# EAGLE design Audio Board (EAGLE 9.3.1)

## Sheet 1 of 3
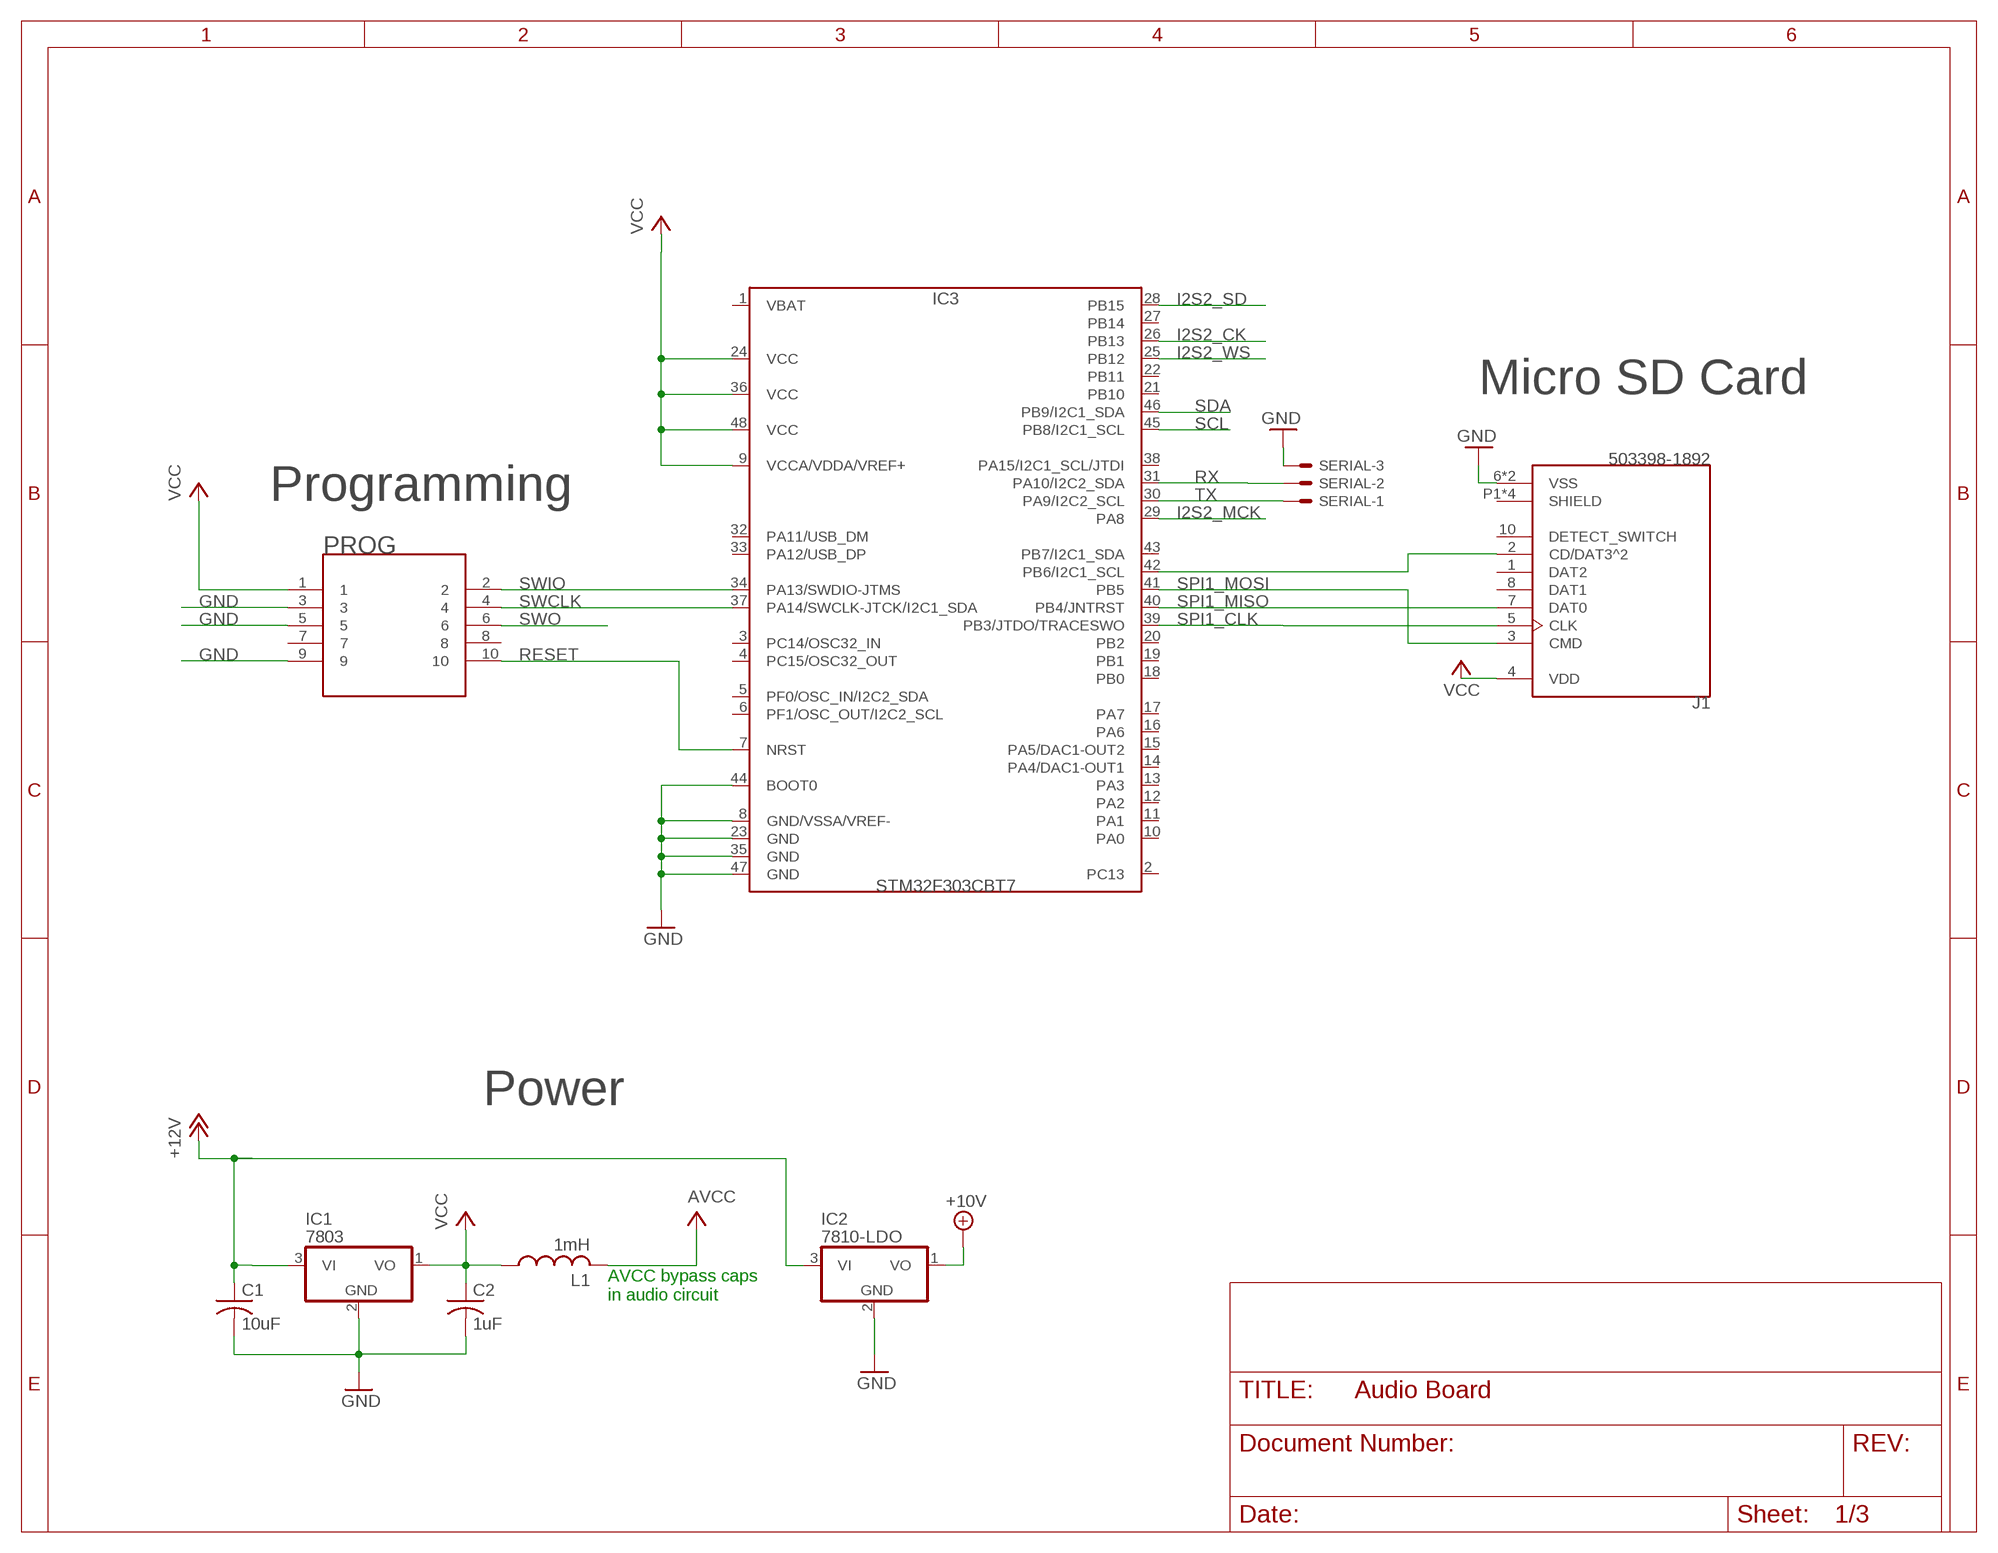
[diagram p0: schematic, sheet 1]

### Parts
C1  10uF  C-US025-025X050  [C025-025X050]
C2  1uF  C-US025-025X050  [C025-025X050]
IC1  7803  78L05Z  [TO92]
IC2  7810-LDO  78L05Z  [TO92]
IC3  STM32F303CBT7  [LQFP48]
J1  503398-1892  [MOLEX_503398-1892]
L1  1mH  L-US0207/10  [0207/10]
PROG  CORTEX_HEADERJ  [CORTEX_HEADER]
SERIAL  22-23-2031  [22-23-2031]

### Nets
+10V [power]: IC2.1(VO) ; also sheet 3
+12V [power]: C1.1 IC1.3(VI) IC2.3(VI) ; also sheet 3
GND [power]: C1.2 C2.2 IC1.2(GND) IC2.2(GND) IC3.8(GND/VSSA/VREF-) IC3.23(GND) IC3.35(GND) IC3.44(BOOT0) IC3.47(GND) J1.6(VSS) J1.9(VSS) PROG.3 PROG.5 PROG.9 SERIAL.3 ; also sheet 2,3
I2S2_CK: IC3.26(PB13) ; also sheet 2
I2S2_MCK: IC3.29(PA8) ; also sheet 2
I2S2_SD: IC3.28(PB15) ; also sheet 2
I2S2_WS: IC3.25(PB12) ; also sheet 2
N$1: IC3.42(PB6/I2C1_SCL) J1.2(CD/DAT3^2)
RESET: IC3.7(NRST) PROG.10
RX: IC3.31(PA10/I2C2_SDA) SERIAL.2
SCL: IC3.45(PB8/I2C1_SCL) ; also sheet 3
SDA: IC3.46(PB9/I2C1_SDA) ; also sheet 3
SPI1_CLK: IC3.39(PB3/JTDO/TRACESWO) J1.5(CLK)
SPI1_MISO: IC3.40(PB4/JNTRST) J1.7(DAT0)
SPI1_MOSI: IC3.41(PB5) J1.3(CMD)
SWCLK: IC3.37(PA14/SWCLK-JTCK/I2C1_SDA) PROG.4
SWIO: IC3.34(PA13/SWDIO-JTMS) PROG.2
SWO: PROG.6
TX: IC3.30(PA9/I2C2_SCL) SERIAL.1
V+: L1.2 ; supply symbol labelled AVCC ; also sheet 2
VCC [power]: C2.1 IC1.1(VO) IC3.9(VCCA/VDDA/VREF+) IC3.24(VCC) IC3.36(VCC) IC3.48(VCC) J1.4(VDD) L1.1 PROG.1 ; also sheet 3
Unconnected: IC3.1(VBAT) IC3.2(PC13) IC3.3(PC14/OSC32_IN) IC3.4(PC15/OSC32_OUT) IC3.5(PF0/OSC_IN/I2C2_SDA) IC3.6(PF1/OSC_OUT/I2C2_SCL) IC3.10(PA0) IC3.11(PA1) IC3.12(PA2) IC3.13(PA3) IC3.14(PA4/DAC1-OUT1) IC3.15(PA5/DAC1-OUT2) IC3.16(PA6) IC3.17(PA7) IC3.18(PB0) IC3.19(PB1) IC3.20(PB2) IC3.21(PB10) IC3.22(PB11) IC3.27(PB14) IC3.32(PA11/USB_DM) IC3.33(PA12/USB_DP) IC3.38(PA15/I2C1_SCL/JTDI) IC3.43(PB7/I2C1_SDA) J1.1(DAT2) J1.8(DAT1) J1.10(DETECT_SWITCH) J1.P1(SHIELD) J1.P2(SHIELD) J1.P3(SHIELD) J1.P4(SHIELD) PROG.7 PROG.8

### Notes on the sheet
- Micro SD Card
- Programming
- Power
- AVCC bypass caps
  in audio circuit

## Sheet 2 of 3
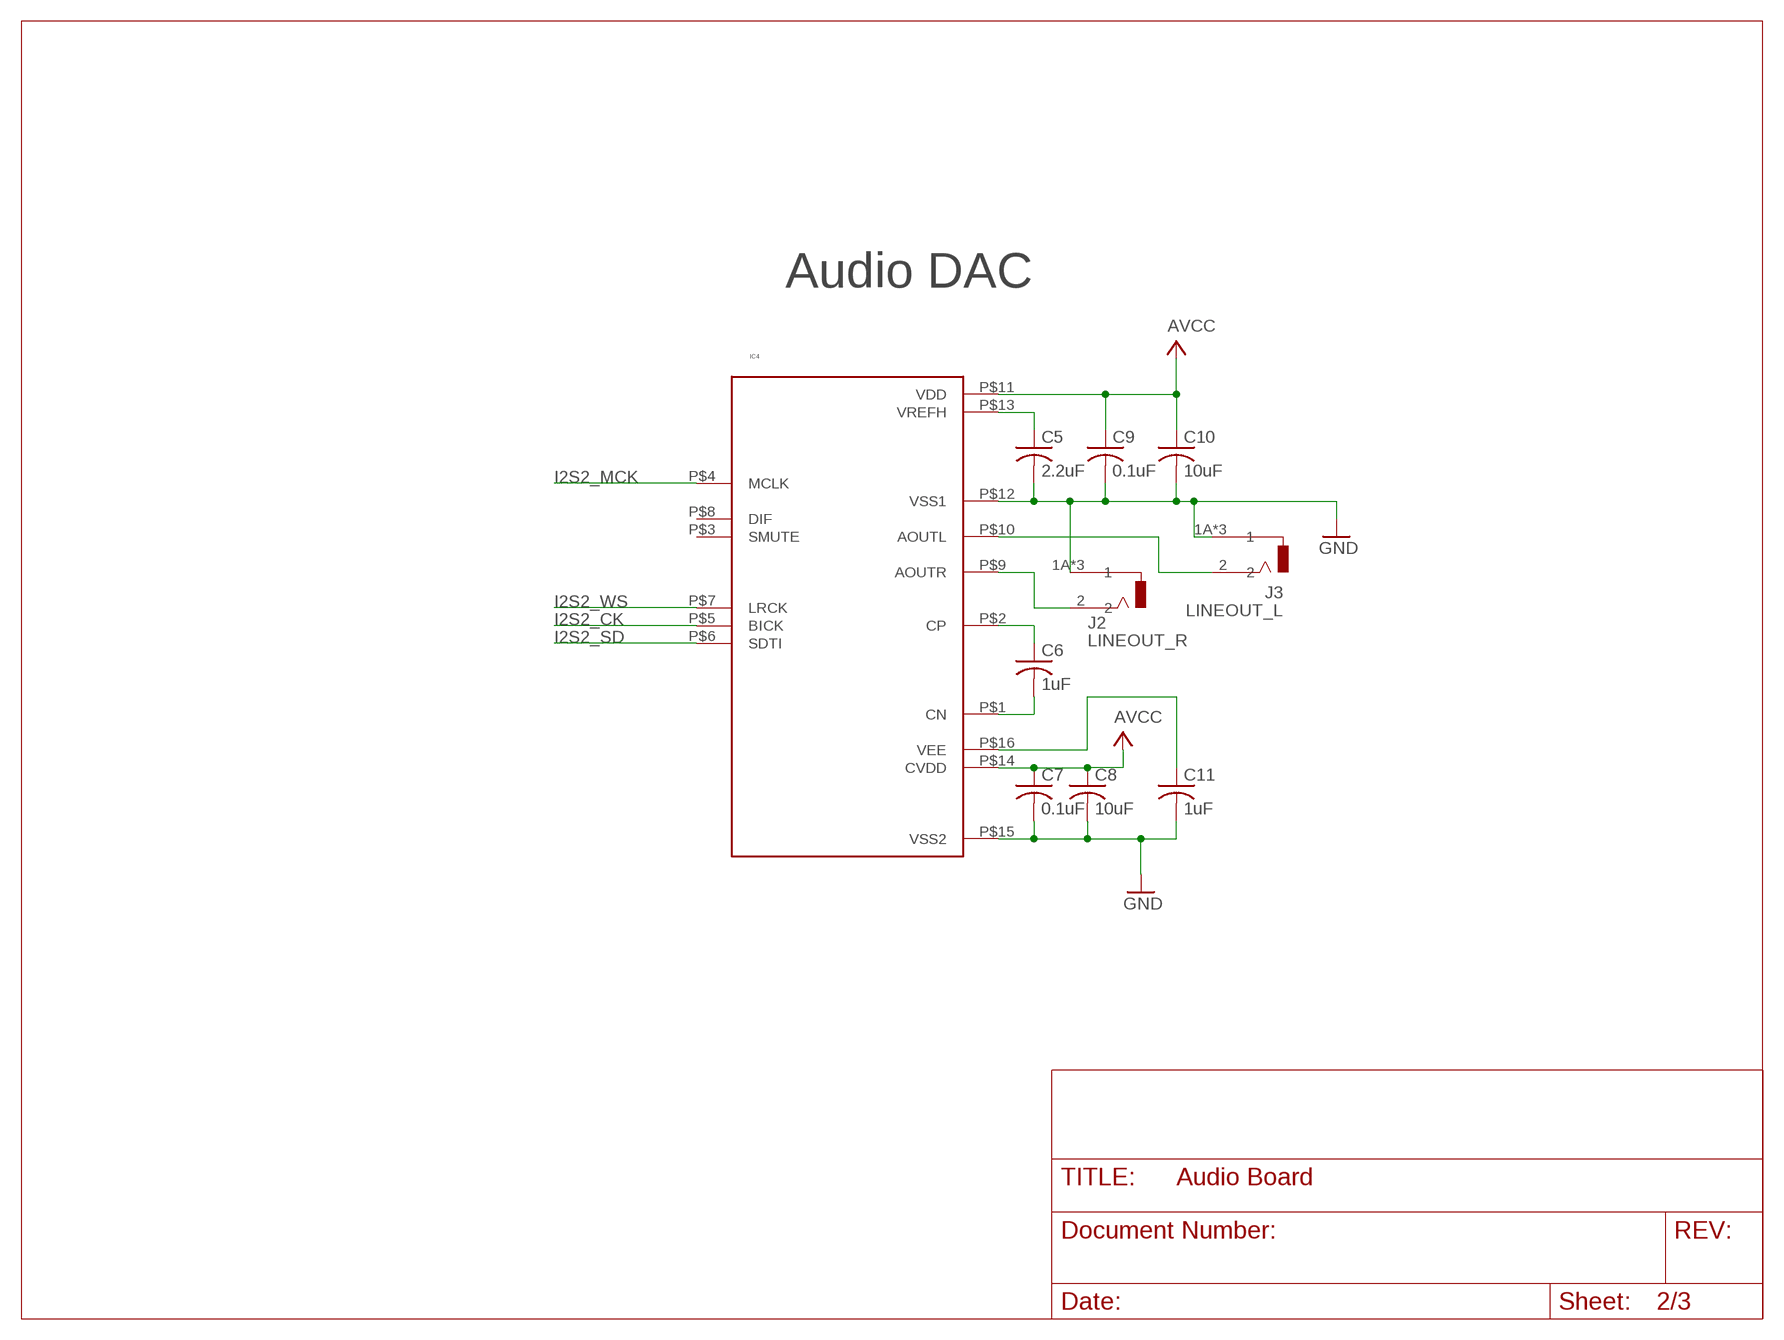
[diagram p1: schematic, sheet 2]

### Parts
C5  2.2uF  C-US025-025X050  [C025-025X050]
C6  1uF  C-US025-025X050  [C025-025X050]
C7  0.1uF  C-US025-025X050  [C025-025X050]
C8  10uF  C-US025-025X050  [C025-025X050]
C9  0.1uF  C-US025-025X050  [C025-025X050]
C10  10uF  C-US025-025X050  [C025-025X050]
C11  1uF  C-US025-025X050  [C025-025X050]
IC4  AK4430ET  [16TSSOP]
J2  LINEOUT_R  RCJ-012  [CUI_RCJ-012]
J3  LINEOUT_L  RCJ-012  [CUI_RCJ-012]

### Nets
GND [power]: C5.2 C7.2 C8.2 C9.2 C10.2 C11.2 IC4.P$12(VSS1) IC4.P$15(VSS2) J2.1A J2.1B J2.1C J3.1A J3.1B J3.1C ; also sheet 1,3
GND1 [power]: C6.2 IC4.P$1(CN)
I2S2_CK: IC4.P$5(BICK) ; also sheet 1
I2S2_MCK: IC4.P$4(MCLK) ; also sheet 1
I2S2_SD: IC4.P$6(SDTI) ; also sheet 1
I2S2_WS: IC4.P$7(LRCK) ; also sheet 1
N$2: C11.1 IC4.P$16(VEE)
N$3: IC4.P$10(AOUTL) J3.2
N$4: IC4.P$9(AOUTR) J2.2
N$5: C5.1 IC4.P$13(VREFH)
V+: C7.1 C8.1 C9.1 C10.1 IC4.P$11(VDD) IC4.P$14(CVDD) ; supply symbol labelled AVCC ; also sheet 1
V+1: C6.1 IC4.P$2(CP)
Unconnected: IC4.P$3(SMUTE) IC4.P$8(DIF)

### Notes on the sheet
- Audio DAC

## Sheet 3 of 3
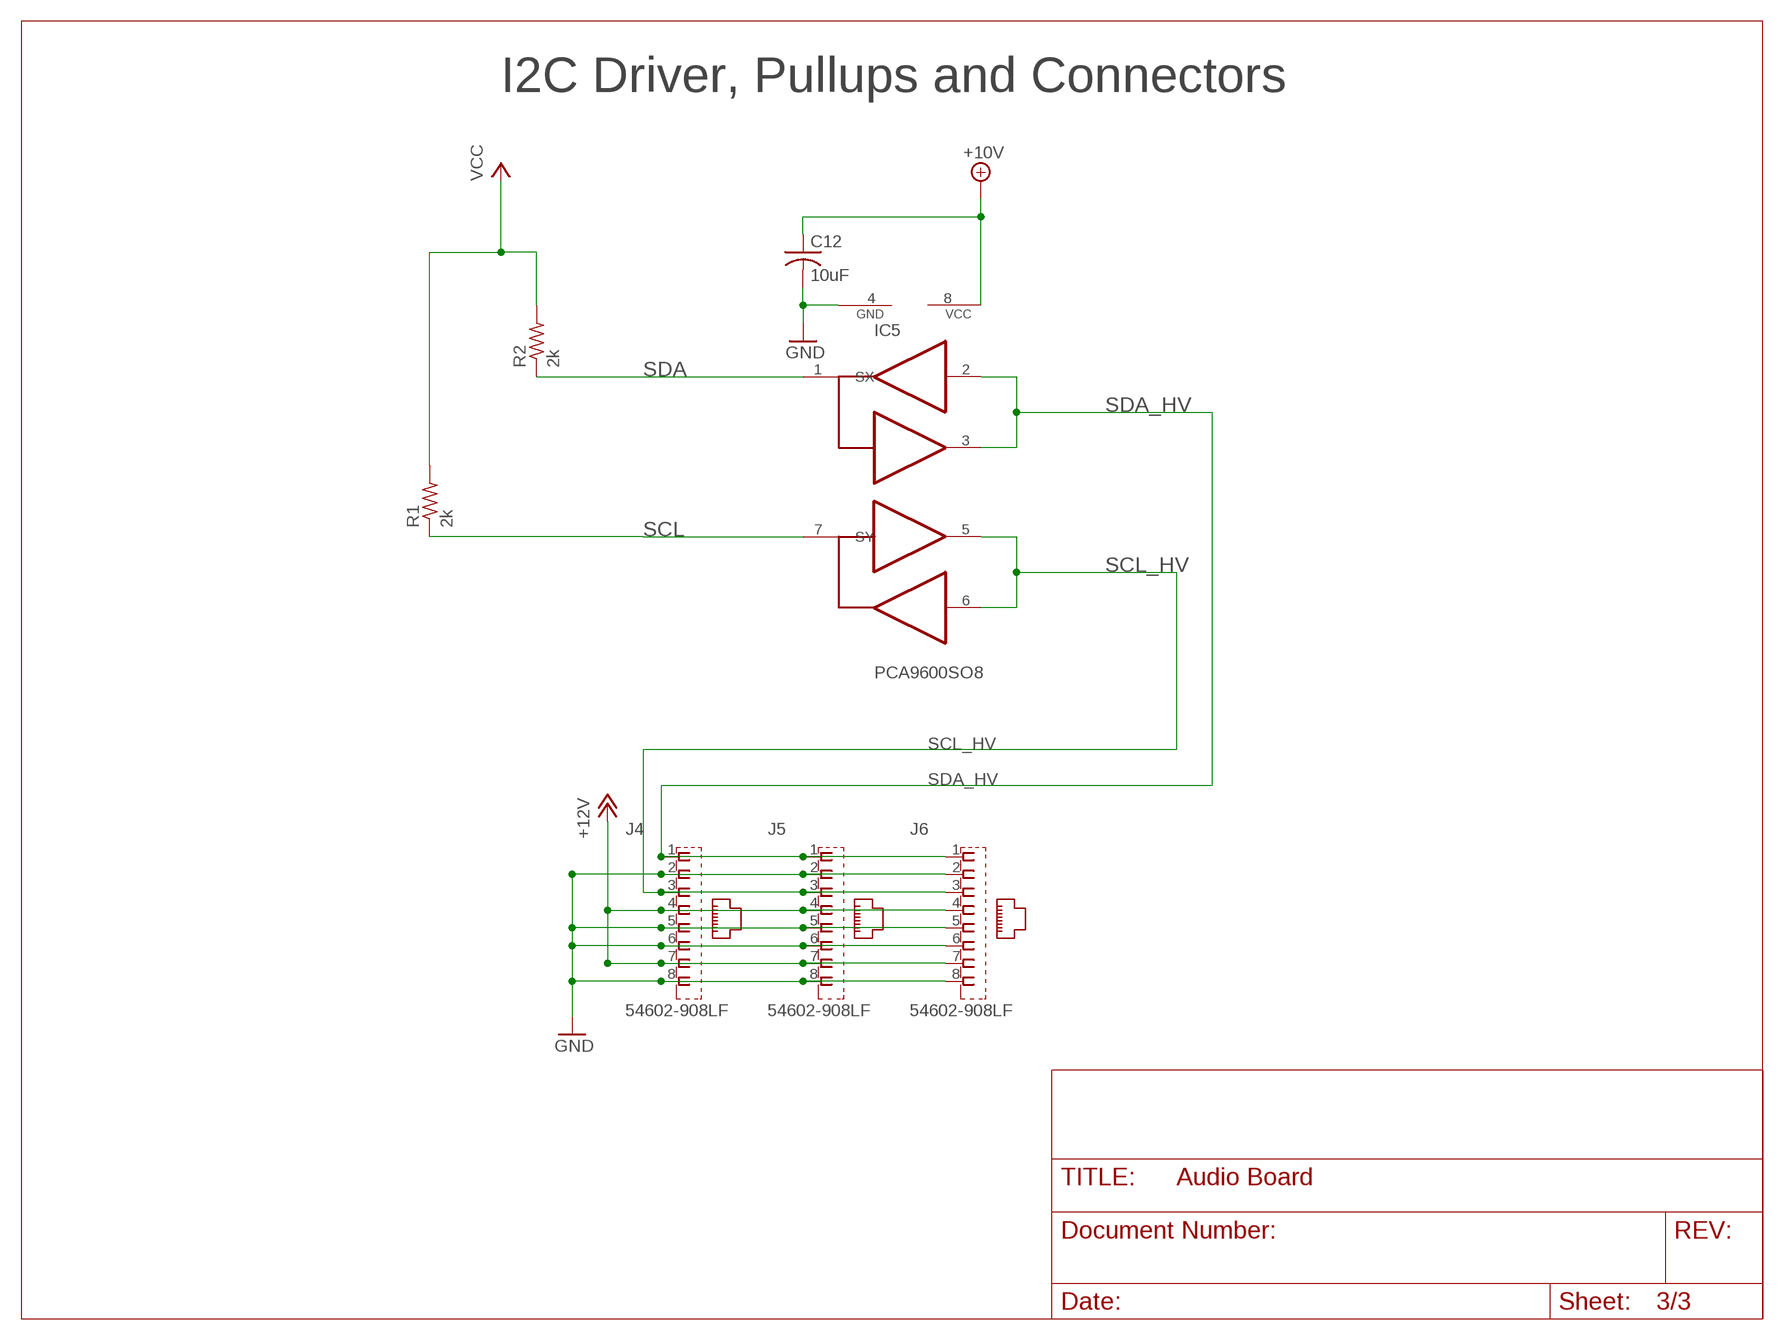
[diagram p2: schematic, sheet 3]

### Parts
C12  10uF  C-US025-025X050  [C025-025X050]
IC5  PCA9600SO8  [SO08]
J4  54602-908LF  [AMPHENOL_54602-908LF]
J5  54602-908LF  [AMPHENOL_54602-908LF]
J6  54602-908LF  [AMPHENOL_54602-908LF]
R1  2k  R-US_0204/5  [0204/5]
R2  2k  R-US_0204/5  [0204/5]

### Nets
+10V [power]: C12.1 IC5.8(VCC) ; also sheet 1
+12V [power]: J4.4 J4.7 J5.4 J5.7 J6.4 J6.7 ; also sheet 1
GND [power]: C12.2 IC5.4(GND) J4.2 J4.5 J4.6 J4.8 J5.2 J5.5 J5.6 J5.8 J6.2 J6.5 J6.6 J6.8 ; also sheet 1,2
SCL: IC5.7(SY) R1.1 ; also sheet 1
SCL_HV: IC5.5(TY) IC5.6(RY) J4.3 J5.3 J6.3
SDA: IC5.1(SX) R2.1 ; also sheet 1
SDA_HV: IC5.2(RX) IC5.3(TX) J4.1 J5.1 J6.1
VCC [power]: R1.2 R2.2 ; also sheet 1

### Notes on the sheet
- I2C Driver, Pullups and Connectors

## Library data of the parts
C1 C2 C5-C12 = rcl:C-US: CAPACITOR, American symbol; SPICEPREFIX: C
IC1 IC2 = linear:78*: Positive VOLTAGE REGULATOR Source: http://cache.national.com/ds/LM/LM78L05.pdf http://www.fairchildsemi.com/ds/LM/LM7805.pdf
IC3 = STM32F303CBT7:STM32F303CBT7; AVAILABILITY: Unavailable; DESCRIPTION: MCU, 32BIT, CORTEX-M4, 72MHZ, LQFP-48; Controller Family/Series: STM32F; Core Siz; MF: STMicroelectronics; MP: STM32F303CBT7; PACKAGE: LQFP-48 STMicroelectronics; PRICE: None
IC4 = AK4430ET:AK4430ET
IC5 = 4534_I2C2:PCA9600: I2C ACTIVE TERMINATOR SO-8
J1 = 503398-1892:503398-1892: 1.10mm Pitch microSD Memory Card Connector, Normal Mount Surface Mount, Push-Push Type, 1.28mm Height; AVAILABILITY: Unavailable; DESCRIPTION: 1.10mm Pitch microSD Memory Card Connector, Normal Mount Surface Mount, Push-Push Type, 1.28mm Height; MF: Molex; MP: 503398-1892; PACKAGE: None; PRICE: None
J2 J3 = RCJ-012:RCJ-012: Metal Right-Angle, RCA Jack, Red Insulator; AVAILABILITY: Unavailable; CUI_PURCHASE_URL: https://www.cui.com/product/interconnect/rca-connectors/rcj-01-series?utm_source=snapeda.com&utm_medium=referral&utm_campaign=snapedaBOM; DESCRIPTION: Unshielded Through Hole Right Angle Mono Female Phono _RCA_ Jack; MF: CUI Inc.; MP: RCJ-012; PACKAGE: None; PRICE: None
J4-J6 = 54602-908LF:54602-908LF: CONN MOD JACK 8P8C R/A UNSHLD; DESCRIPTION: Cat3 Rj45 Modular Jack, 8 Position, 1 Port; DIGI-KEY_PART_NUMBER: 609-1046-ND; DIGI-KEY_PURCHASE_URL: https://www.digikey.com/product-detail/en/amphenol-icc-fci/54602-908LF/609-1046-ND/1001360?utm_source=snapeda&utm_medium=aggregator&utm_campaign=symbol; MF: Amphenol ICC; MP: 54602-908LF; PACKAGE: None
L1 = rcl:L-US: INDUCTOR, American symbol; SPICEPREFIX: L
PROG = Lectrobox:CORTEX_HEADER; AVAILABILITY: Unavailable; DESCRIPTION: Conn Shrouded Header HDR 10 POS 1.27mm Solder ST Thru-Hole Tube; MF: Samtec Inc.; MP: TFM-105-01-S-D-WT; PACKAGE: None; PRICE: None
R1 R2 = rcl:R-US_: RESISTOR, American symbol; SPICEPREFIX: R
SERIAL = con-molex:22-23-2031: .100" (2.54mm) Center Header - 3 Pin; MF: MOLEX; MPN: 22-23-2031; OC_FARNELL: 1462950; OC_NEWARK: 30C0862

## Net classes
1 power: width 0.305 mm, clearance 0.152 mm to class 0, clearance 0.152 mm

## Board
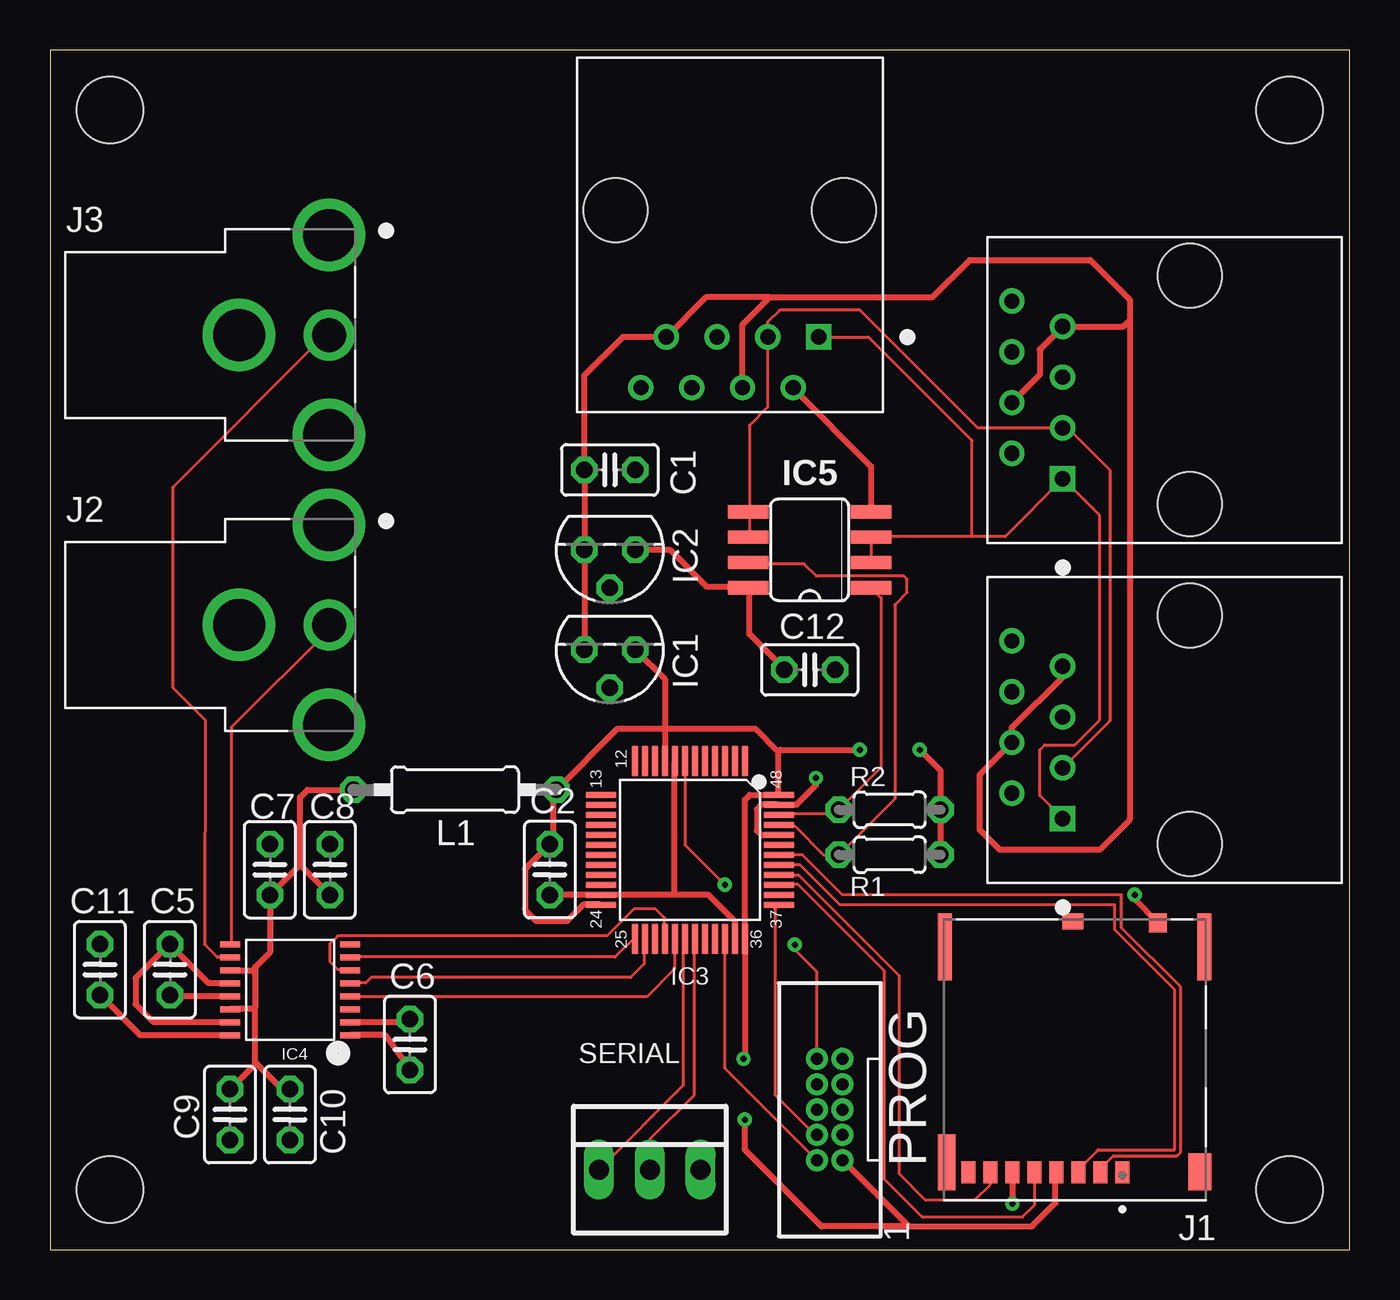
[diagram p3: board, top side]
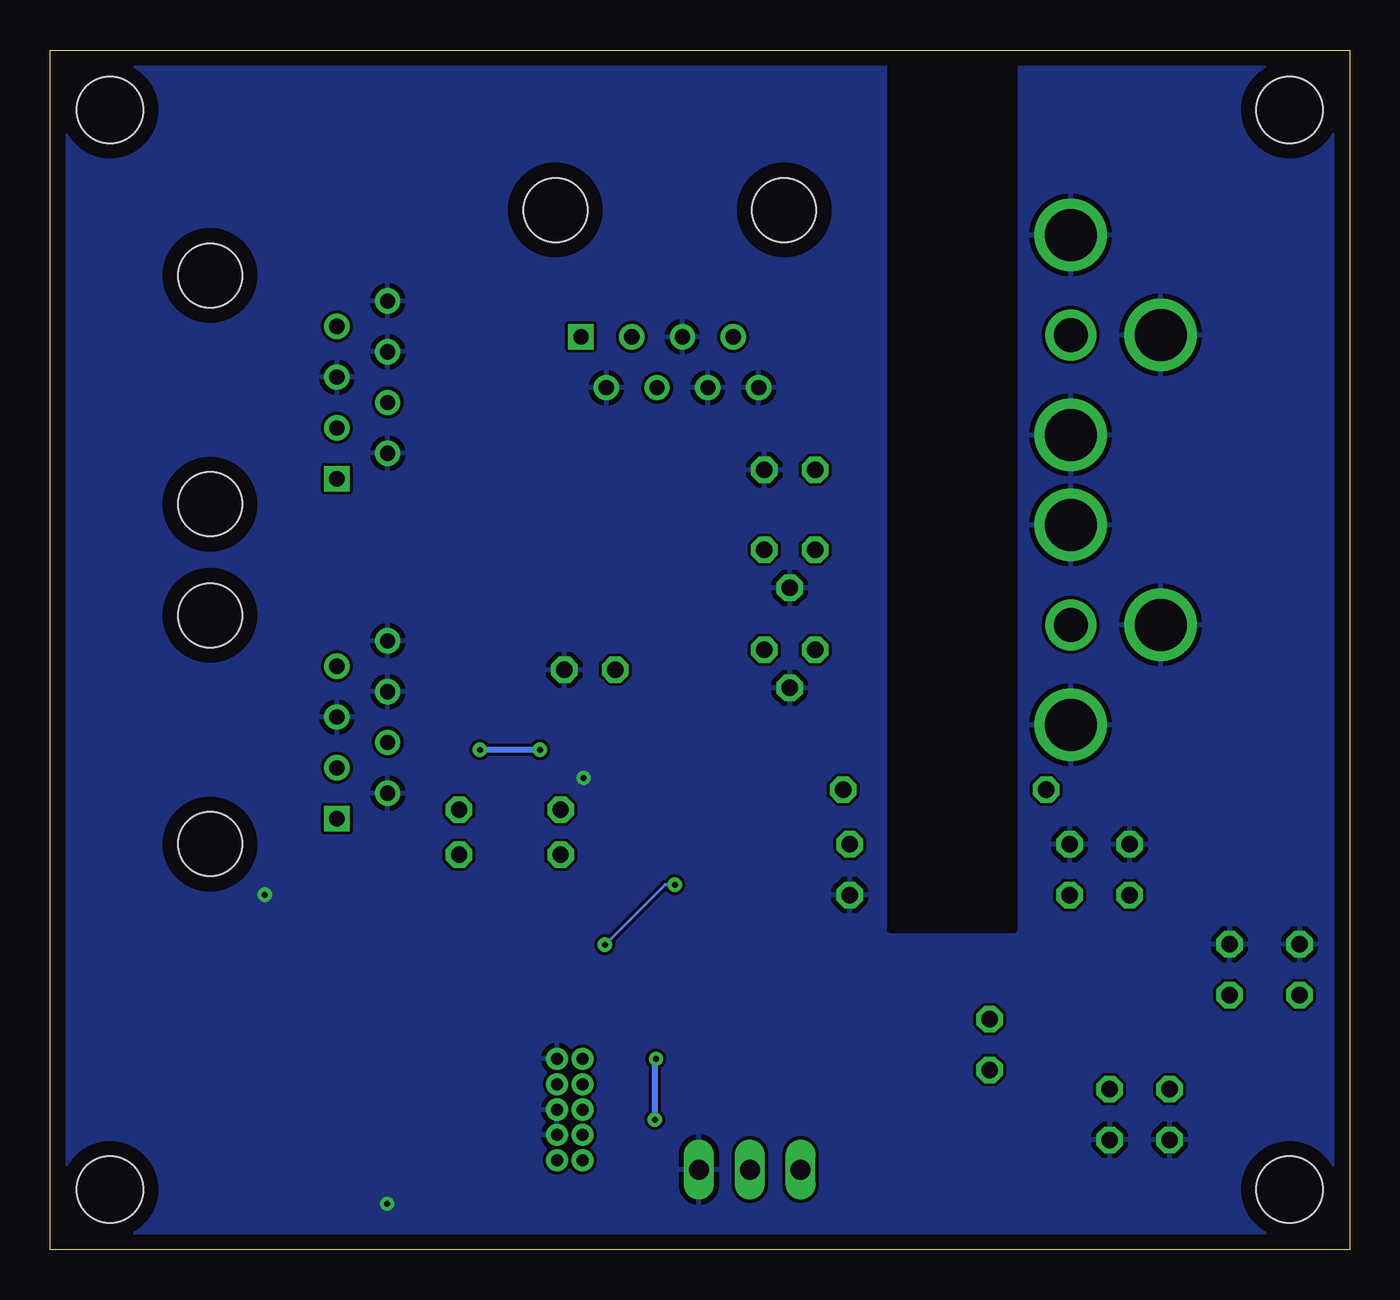
[diagram p4: board, bottom side, seen from below]

Size 65 x 60 mm. Coordinates in mm from the lower left corner, seen from the top.
Outline: 0,0 65,0 65,60 0,60 0,0
Copper layers (1*16): Top 0.035mm / dielectric 1.5mm / Bottom 0.035mm
Design rules "default *": minimum track width 6mil, minimum drill 0.3mm, track to track 6mil, track to pad 6mil, pad to pad 6mil, via to via 8mil, smd to smd 6mil, copper to edge 30mil, drill to drill 8mil, minimum pad ring 10mil, minimum via ring 8mil, stop-mask expansion 4mil, vias tented up to drill 13mil, thermal gap 10mil
tRestrict: area 17,16 to 23,59.2
bRestrict: area 16.8,16 to 23,59.5

### Footprints (pad centres in the part's own frame; a part is rotated, then mirrored left to right if it is on the bottom)
C025-025X050 = drill 0.813 octagon: 1 -1.27,0; 2 1.27,0
TO92 = drill 0.813 octagon: 1 -1.27,0; 2 0,1.905; 3 1.27,0
LQFP48 = smd 1.5 x 0.3: 1 -4.45,2.75; 2 -4.45,2.25; 3 -4.45,1.75; 4 -4.45,1.25; 5 -4.45,0.75; 6 -4.45,0.25; 7 -4.45,-0.25; 8 -4.45,-0.75; 9 -4.45,-1.25; 10 -4.45,-1.75; 11 -4.45,-2.25; 12 -4.45,-2.75; 25 4.45,-2.75; 26 4.45,-2.25; 27 4.45,-1.75; 28 4.45,-1.25; 29 4.45,-0.75; 30 4.45,-0.25; 31 4.45,0.25; 32 4.45,0.75; 33 4.45,1.25; 34 4.45,1.75; 35 4.45,2.25; 36 4.45,2.75 | smd 0.3 x 1.5: 13 -2.75,-4.45; 14 -2.25,-4.45; 15 -1.75,-4.45; 16 -1.25,-4.45; 17 -0.75,-4.45; 18 -0.25,-4.45; 19 0.25,-4.45; 20 0.75,-4.45; 21 1.25,-4.45; 22 1.75,-4.45; 23 2.25,-4.45; 24 2.75,-4.45; 37 2.75,4.45; 38 2.25,4.45; 39 1.75,4.45; 40 1.25,4.45; 41 0.75,4.45; 42 0.25,4.45; 43 -0.25,4.45; 44 -0.75,4.45; 45 -1.25,4.45; 46 -1.75,4.45; 47 -2.25,4.45; 48 -2.75,4.45
16TSSOP = smd 0.3 x 1: P$1 -2.275,-3; P$2 -1.625,-3; P$3 -0.975,-3; P$4 -0.325,-3; P$5 0.325,-3; P$6 0.975,-3; P$7 1.625,-3; P$8 2.275,-3; P$9 2.275,3; P$10 1.625,3; P$11 0.975,3; P$12 0.325,3; P$13 -0.325,3; P$14 -0.975,3; P$15 -1.625,3; P$16 -2.275,3
SO08 = smd 0.66 x 2.032: 1 -1.905,-3.073; 2 -0.635,-3.073; 3 0.635,-3.073; 4 1.905,-3.073; 5 1.905,3.073; 6 0.635,3.073; 7 -0.635,3.073; 8 -1.905,3.073
MOLEX_503398-1892 = smd 0.7 x 1.1: 1 -2.38,5.625; 2 -1.28,5.625; 3 -0.18,5.625; 4 0.92,5.625; 5 2.02,5.625; 6 3.12,5.625; 7 4.22,5.625; 8 5.32,5.625 | smd 0.9 x 0.93: 9 -4.17,-6.84 | smd 1.05 x 0.78: 10 0.095,-6.915 | smd 1.14 x 1.83: P1 -6.26,5.61 | smd 0.86 x 2.8: P2 6.4,5.125 | smd 0.7 x 3.33: P3 -6.48,-5.64; P4 6.48,-5.64
CUI_RCJ-012 = drill 2.6: 1A 5.95,5; 1B 5.95,-5; 1C 1.45,0 | drill 1.7: 2 5.95,0
AMPHENOL_54602-908LF = drill 0.76 square: 1 -4.445,6.35 | drill 0.76: 2 -3.175,8.89; 3 -1.905,6.35; 4 -0.635,8.89; 5 0.635,6.35; 6 1.905,8.89; 7 3.175,6.35; 8 4.445,8.89 | hole 3.2: -5.715,0; 5.715,0
0207/10 = drill 0.813 octagon: 1 -5.08,0; 2 5.08,0
CORTEX_HEADER = drill 0.6 pad 1: 1 -2.54,-0.635; 2 -2.54,0.635; 3 -1.27,-0.635; 4 -1.27,0.635; 5 0,-0.635; 6 0,0.635; 7 1.27,-0.635; 8 1.27,0.635; 9 2.54,-0.635; 10 2.54,0.635
0204/5 = drill 0.813 octagon: 1 -2.54,0; 2 2.54,0
22-23-2031 = drill 1 long: 1 -2.54,0; 2 0,0; 3 2.54,0
STAND-OFF = hole 3.302: 0,0

### Placement (x,y rotation side)
C1  28,39 0 top
C2  25,19 270 top
C5  6,14 90 top
C6  18,10.25 270 top
C7  11,19 90 top
C8  14,19 90 top
C9  9,6.75 270 top
C10  12,6.75 270 top
C11  2.5,14 90 top
C12  38,29 0 top
IC1  28,30 180 top
IC2  28,35 180 top
IC3  32,20 270 top
IC4  12,13 90 top
IC5  38,35 90 top
J1  51.25,9.5 180 top
J2  8,31.25 0 top
J3  8,45.75 0 top
J4  57,43 90 top
J5  34,52 180 top
J6  57,26 90 top
L1  20.25,23 180 top
PROG  39,7 90 top
R1  42,19.75 0 top
R2  42,22 0 top
SERIAL  30,4 0 top
U$1  [STAND-OFF]  3,57 0 top
U$2  [STAND-OFF]  62,57 0 top
U$3  [STAND-OFF]  62,3 0 top
U$4  [STAND-OFF]  3,3 0 top

### Tracks (layer width: path | path; a pad name or v marks a point on that pad's centre or on a via)
+10V
  Top 0.305: C12.1 36.73,29.03 34.98,30.79 34.98,33.07 IC5.8 34.82,33.15 32.87,33.15 31.04,34.98 29.34,34.98 IC2.1
+12V
  Top 0.305: 26.75,34.98 26.75,30.02 IC1.3 | 26.75,34.98 IC2.3 | 36.01,47.63 44.13,47.63 46,49.5 52.02,49.5 54,47.52 54,46.5 | J4.4 49.5,43.76 49.5,45.02 J4.7 53.67,46.17 54,46.5 | 54,46.5 54,21.5 52.5,20 47.5,20 46.5,21 46.5,23.75 J6.4 48.11,26.11 50.65,28.65 J6.7 | 36.01,47.63 32.81,47.63 J5.7 28.65,45.65 26.73,43.73 C1.1 26.75,38.98 26.75,34.98 | J5.4 34.63,46.26 36.01,47.63
GND  (via drill 0.3)
  Top 0.305: IC3.44 36.42,20.73 35.59,20.73 35.36,20.95 35.36,22.02 35.59,22.25 36.42,22.25 IC3.47 36.58,22.25 37.34,22.25 38.31,23.23 v38.31,23.58 | IC4.P$12 8.99,13.34 7.92,13.34 6.1,15.16 C5.2 5.94,15.24 4.28,13.58 4.28,12.27 5.17,11.38 IC4.P$15 | C2.2 25.07,17.75 27.51,17.75 IC3.23 27.66,17.75 31.24,17.75 | IC3.35 34.25,16.42 32.92,17.75 31.24,17.75 | 31.24,17.75 31.24,24.38 IC3.8 | IC5.4 41.07,36.96 41.07,39.17 37.19,43.05 J5.2 | J1.6 v48.13,2.28 | J1.9 54.25,17.51 v54.25,17.75
  pour Bottom: 0,60 65,60 65,0 0,0
GND1
  Top 0.305: IC4.P$1 16.76,10.73 C6.2
I2S2_CK
  Top 0.152: IC4.P$5 15.01,13.34 15.8,13.34 16.07,13.61 29.05,13.61 29.72,14.28 29.72,15.54 IC3.26
I2S2_MCK
  Top 0.152: IC4.P$4 15.03,12.64 29.85,12.64 31.24,14.03 IC3.29
I2S2_SD
  Top 0.152: IC4.P$6 14.94,14.02 14.38,14.02 14,14.4 14,15.29 14.4,15.7 27.87,15.7 29.21,17.04 30.29,17.04 30.74,16.59 30.74,15.57 IC3.28
I2S2_WS
  Top 0.152: IC4.P$7 28.27,14.63 29.18,15.54 IC3.25
N$1
  Top 0.152: J1.2 52.53,4.03 53.2,4.7 56.38,4.7 56.55,4.87 56.55,13.13 53.59,16.09 53.59,17.75 39.62,17.75 37.62,19.75 IC3.42
N$2
  Top 0.305: C11.1 4.5,10.72 IC4.P$16
N$3
  Top 0.152: IC4.P$10 8.36,14.63 7.73,15.26 7.75,26.5 6.14,28.11 6.14,38.12 13.75,45.73 J3.2
N$4
  Top 0.152: J2.2 13.95,31 9.07,26.12 9.07,15.32 IC4.P$9
N$5
  Top 0.305: IC4.P$13 6.05,12.68 C5.1
RESET  (via drill 0.3)
  Top 0.152: IC3.7 31.75,24.38 31.75,20.25 v33.75,18.25 | PROG.10 38.37,13.88 37.25,15 v37.25,15.25
  Bottom 0.152: v37.25,15.25 34.25,18.25 v33.75,18.25
RX
  Top 0.152: IC3.31 32.23,15.54 32.23,7.75 30.02,5.54 30,5.5 SERIAL.2
SCL
  Top 0.152: IC3.45 36.5,21.18 37.26,21.18 38.7,19.75 R1.1 42.25,22.54 42.25,32.25 42.87,32.87 42.87,33.53 42.72,33.68 38.33,33.68 37.72,34.29 34.98,34.29 IC5.7
SCL_HV
  Top 0.152: IC5.6 34.98,35.66 34.98,36.88 IC5.5 34.98,36.96 34.98,41.22 35.89,42.13 35.89,45.64 J5.3 35.91,46.41 36.5,47 40.5,47 46.41,41.09 J4.3 50.91,41.09 53,39 53,26.45 J6.3
SDA
  Top 0.152: IC3.46 36.5,21.79 39.24,21.79 39.4,21.95 R2.1 39.47,22.02 41.57,24.12 41.57,32.6 IC5.1
SDA_HV
  Top 0.152: IC5.2 41.07,35.59 IC5.3 41.15,35.66 42.37,35.66 43.37,35.66 46.12,35.66 | 46.12,35.66 47.78,35.66 47.82,35.7 50.6,38.48 J4.1 52.5,36.7 52.5,26.5 51.25,25.25 49.75,25.25 49.5,25 49.5,22.7 J6.1 | J5.1 40.94,45.65 46.12,40.47 46.12,35.66
SPI1_CLK
  Top 0.152: J1.5 49.23,2.21 48.64,1.62 43.62,1.62 41.72,3.54 41.72,13.96 37.42,18.26 IC3.39
SPI1_MISO
  Top 0.152: IC3.40 36.5,18.75 37.44,18.75 42.46,13.72 42.46,3.8 43.77,2.49 46.27,2.49 47.03,3.25 J1.7
SPI1_MOSI
  Top 0.152: J1.3 51.43,4 52.43,5 56.25,5 56.25,13 53.25,16 53.25,17.25 39.5,17.25 37.5,19.25 IC3.41
SWCLK
  Top 0.152: IC3.37 36.25,17.05 36.25,7.75 38.25,5.75 PROG.4
SWIO
  Top 0.152: IC3.34 33.76,9.07 38.33,4.5 PROG.2
TX
  Top 0.152: IC3.30 31.7,15.54 31.7,8.23 27.51,4.04 SERIAL.1
V+
  Top 0.152: 11,17.62 C7.1 | IC4.P$14
  Top 0.305: 10.25,12.03 IC4.P$14 | 10.25,13.75 10.25,14.12 11,14.88 11,17.62 | 10.25,13.75 10.25,12.12 10.25,12.03 | 10.25,9.38 10.25,12.03 | 12.5,19.75 12.5,19.25 14,17.75 C8.1 | 12.5,19.75 12.5,22.62 12.88,23 L1.2 | IC4.P$11 10.25,13.97 10.25,13.75 | C10.1 11.61,8.02 10.25,9.38 | C7.1 12.5,19.23 12.5,19.75 | C9.1 10.25,9.27 10.25,9.38
V+1
  Top 0.152: 17.84,11.62 C6.1
  Top 0.305: IC4.P$2 17.59,11.37 17.84,11.62
VCC  (via drill 0.3)
  Top 0.305: IC3.24 | IC3.24 26.68,17.25 25.87,16.43 24.32,16.43 23.82,16.93 23.75,17.05 23.75,19.03 C2.1 25.16,20.43 25.16,22.83 L1.1 28.36,26.03 30.75,26.03 | 30.75,26.12 30.75,28.53 29.34,29.95 IC1.1 | 30.75,26.12 IC3.9 | IC3.9 | 36.42,24.91 36.42,22.78 IC3.48 35,22.75 34.75,22.5 IC3.36 34.75,9.59 v34.7,9.53 | 36.42,24.91 35.3,26.03 30.75,26.03 | 42.97,1.16 49.12,1.16 50.29,2.33 50.29,3.81 J1.4 | 42.97,1.16 42.47,1.66 39.7,4.42 PROG.1 | 42.97,1.16 38.59,1.16 34.75,5 v34.75,6.5 | 36.42,24.91 36.52,25 v40.5,25 | v43.5,25 44.54,23.96 R2.2 R1.2 | 30.75,26.12 | 30.75,26.12 30.75,26.03
  Bottom 0.305: v34.75,6.5 34.75,9.48 v34.7,9.53 | v40.5,25 v43.5,25

### Text on the board
tDocu: RULOS Audio Synthesizer / Rev B April 2019 | TX RX GND